# Altium schematic sheet Input filter.SchDoc
size A4; SheetNumber: 6; SheetTotal: 8
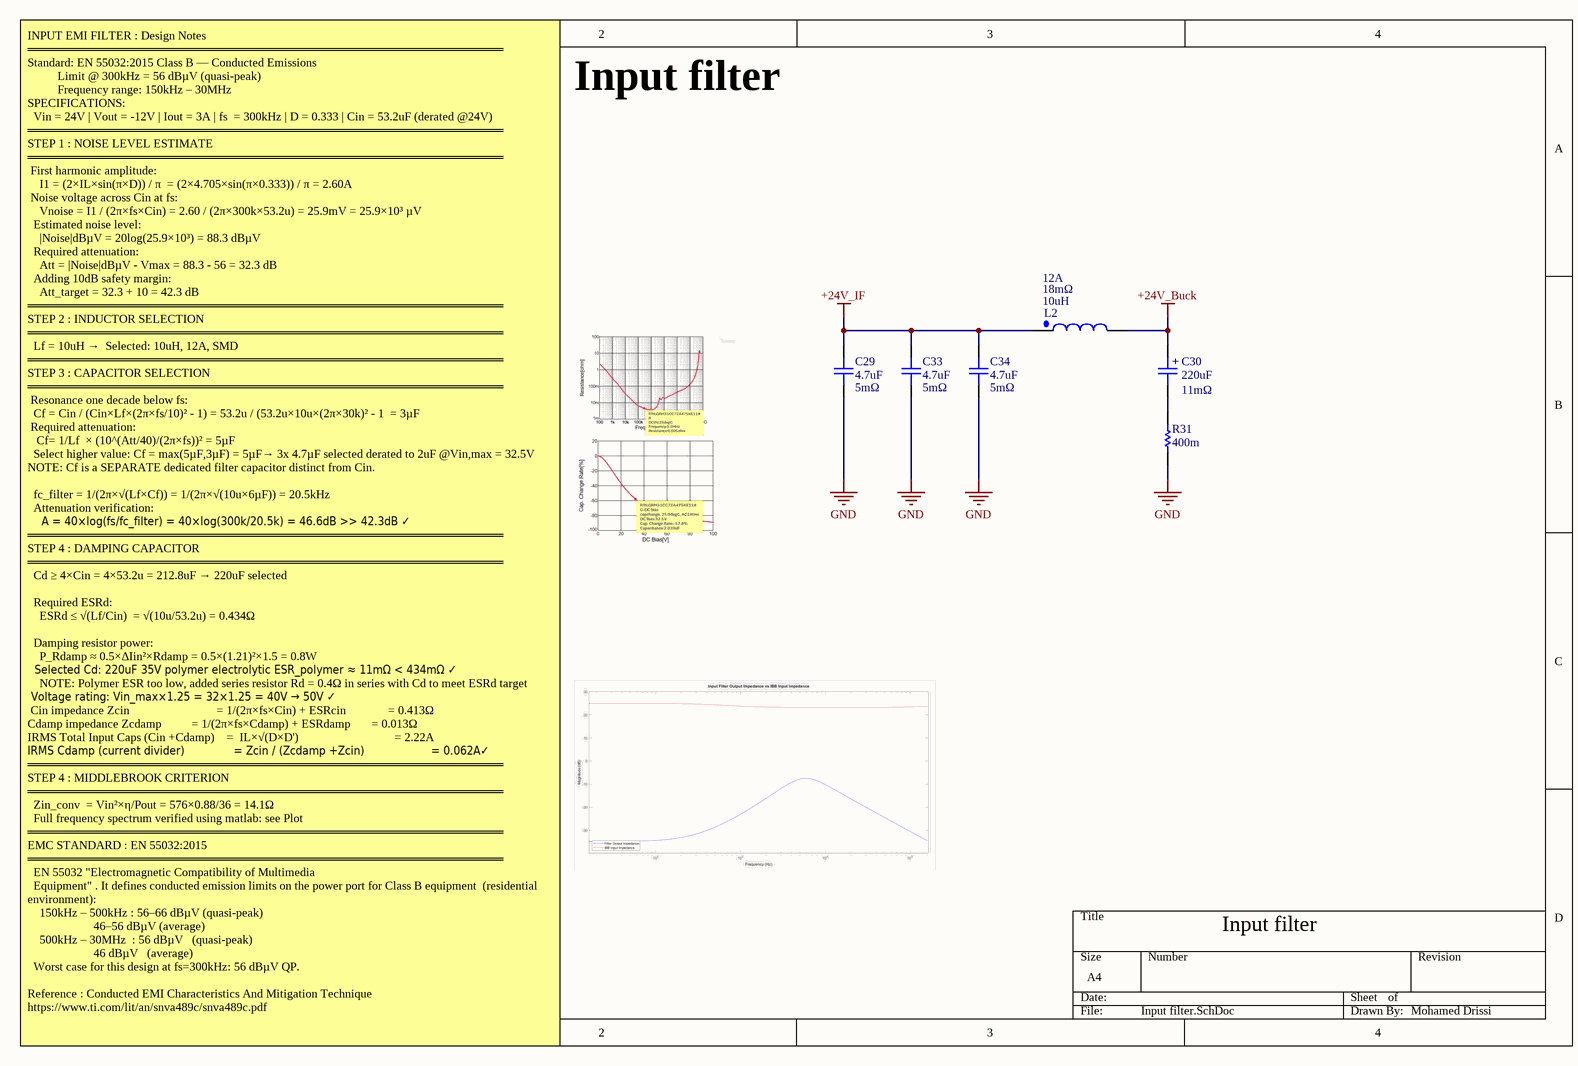
[diagram p0: Input filter.SchDoc]

## Parts
C29  Capacitance: 4.7uF  ESR: 5mΩ  [cap_1206]  (hidden comment: GRM31CC72A475KE11)
C30  ESR (Equivalent Series Resistance): 11mΩ  Capacitance: 220uF  [CAP_POL_10×16.5]  (hidden comment: A786MW227M1HLAS011)
C33  Capacitance: 4.7uF  ESR: 5mΩ  [cap_1206]  (hidden comment: GRM31CC72A475KE11)
C34  Capacitance: 4.7uF  ESR: 5mΩ  [cap_1206]  (hidden comment: GRM31CC72A475KE11)
L2  DC Resistance (DCR): 18mΩ  Max Current Rating: 12A  Inductance: 10uH  [INDPM135125X650N]  (hidden comment: SRP1265CC-100M)
R31  Resistance: 400m  [res_1206]  (hidden comment: MFHA1206R4000FC)

## Nets
+24V_Buck: C30.1 L2.2
+24V_IF: C29.2 C33.2 C34.2 L2.1
GND: C29.1 C33.1 C34.1 R31.1
NetC30_2: C30.2 R31.2

## Notes on the sheet
- Input filter
- INPUT EMI FILTER : Design Notes
  ════════════════════════════════════════════════════════
  Standard: EN 55032:2015 Class B — Conducted Emissions
  Limit @ 300kHz = 56 dBµV (quasi-peak)
  Frequency range: 150kHz – 30MHz
  SPECIFICATIONS:
  Vin = 24V | Vout = -12V | Iout = 3A | fs  = 300kHz | D = 0.333 | Cin = 53.2uF (derated @24V)
  ════════════════════════════════════════════════════════
  STEP 1 : NOISE LEVEL ESTIMATE
  ════════════════════════════════════════════════════════
  First harmonic amplitude:
  I1 = (2×IL×sin(π×D)) / π  = (2×4.705×sin(π×0.333)) / π = 2.60A
  Noise voltage across Cin at fs:
  Vnoise = I1 / (2π×fs×Cin) = 2.60 / (2π×300k×53.2u) = 25.9mV = 25.9×10³ µV
  Estimated noise level:
  |Noise|dBµV = 20log(25.9×10³) = 88.3 dBµV
  Required attenuation:
  Att = |Noise|dBµV - Vmax = 88.3 - 56 = 32.3 dB
  Adding 10dB safety margin:
  Att_target = 32.3 + 10 = 42.3 dB
  ════════════════════════════════════════════════════════
  STEP 2 : INDUCTOR SELECTION
  ════════════════════════════════════════════════════════
  Lf = 10uH →  Selected: 10uH, 12A, SMD
  ════════════════════════════════════════════════════════
  STEP 3 : CAPACITOR SELECTION
  ════════════════════════════════════════════════════════
  Resonance one decade below fs:
  Cf = Cin / (Cin×Lf×(2π×fs/10)² - 1) = 53.2u / (53.2u×10u×(2π×30k)² - 1  = 3µF
  Required attenuation:
  Cf= 1/Lf  × (10^(Att/40)/(2π×fs))² = 5µF
  Select higher value: Cf = max(5µF,3µF) = 5µF→ 3x 4.7µF selected derated to 2uF @Vin,max = 32.5V
  NOTE: Cf is a SEPARATE dedicated filter capacitor distinct from Cin.
  fc_filter = 1/(2π×√(Lf×Cf)) = 1/(2π×√(10u×6µF)) = 20.5kHz
  Attenuation verification:
  A = 40×log(fs/fc_filter) = 40×log(300k/20.5k) = 46.6dB >> 42.3dB ✓
  ════════════════════════════════════════════════════════
  STEP 4 : DAMPING CAPACITOR
  ════════════════════════════════════════════════════════
  Cd ≥ 4×Cin = 4×53.2u = 212.8uF → 220uF selected
  Required ESRd:
  ESRd ≤ √(Lf/Cin)  = √(10u/53.2u) = 0.434Ω
  Damping resistor power:
  P_Rdamp ≈ 0.5×ΔIin²×Rdamp = 0.5×(1.21)²×1.5 = 0.8W
  Selected Cd: 220uF 35V polymer electrolytic ESR_polymer ≈ 11mΩ < 434mΩ ✓
  NOTE: Polymer ESR too low, added series resistor Rd = 0.4Ω in series with Cd to meet ESRd target
  Voltage rating: Vin_max×1.25 = 32×1.25 = 40V → 50V ✓
  Cin impedance Zcin	                            = 1/(2π×fs×Cin) + ESRcin              = 0.413Ω
  Cdamp impedance Zcdamp	         = 1/(2π×fs×Cdamp) + ESRdamp       = 0.013Ω
  IRMS Total Input Caps (Cin +Cdamp)    =  IL×√(D×D')                                = 2.22A
  IRMS Cdamp (current divider)              = Zcin / (Zcdamp +Zcin)                   = 0.062A✓
  ════════════════════════════════════════════════════════
  STEP 4 : MIDDLEBROOK CRITERION
  ════════════════════════════════════════════════════════
  Zin_conv  = Vin²×η/Pout = 576×0.88/36 = 14.1Ω
  Full frequency spectrum verified using matlab: see Plot
  ════════════════════════════════════════════════════════
  EMC STANDARD : EN 55032:2015
  ════════════════════════════════════════════════════════
  EN 55032 "Electromagnetic Compatibility of Multimedia
  Equipment" . It defines conducted emission limits on the power port for Class B equipment  (residential environment):
  150kHz – 500kHz : 56–66 dBµV (quasi-peak)
  46–56 dBµV (average)
  500kHz – 30MHz  : 56 dBµV   (quasi-peak)
  46 dBµV   (average)
  Worst case for this design at fs=300kHz: 56 dBµV QP.
  Reference : Conducted EMI Characteristics And Mitigation Technique  https://www.ti.com/lit/an/snva489c/snva489c.pdf
- Mohamed Drissi
- (in symbol Kemet A786MW227M1HLAS011) +

## Library data of the parts
C29 C33 C34 = Murata GRM31CC72A475KE11L: 100V 4.7uF X7S ±10% 1206 Multilayer Ceramic Capacitors MLCC - SMD/SMT ROHS; Manufacturer: Murata; Manufacturer Lifecycle Status: IN PRODUCTION; Supplier: RS; Supplier Part Number: 2478147P; Manufacturer Part Number: GRM31CC72A475KE11L; RoHS: Compliant; Category: Ceramic Capacitors; Stock: 688; Pricing: 100=0,389, 500=0,329 (EUR); Case/Package: 1206; Dielectric: X7S; Dielectric Material: Ceramic; Export Control Classification Number (ECCN) Code: EAR99; Height: 1.6mm; Harmonized Tariff Schedule (HTS) Code: 8532.24.00.20; Introduction Date: 2017-02-22; Length: 3.2mm; Lifecycle Status: Production; Material: Ceramic; Max Operating Temperature: 125°C; Min Operating Temperature: -55°C; Mounting Technology: Surface Mount; Number of Terminals: 2; REACH SVHC: Yes; Schedule B: 8532240020, 8532240020|8532240020|8532240020|8532240020|8532240020|8532240020, 8532240020|8532240020|8532240020|8532240020|8532240020|8532240020|8532240020, 8532240020|8532240020|8532240020|8532240020|8532240020|8532240020|8532240020|8532240020; Thickness: 1.6mm; Tolerance: 10%; Voltage Rating: 100V; Voltage Rating (DC): 100V; Width: 1.6mm; ComponentLink1URL: https://datasheet.octopart.com:443/GRM31CC72A475KE11L-Murata-datasheet-141280425.pdf?src-supplier=Geoflip; ComponentLink1Description: https://datasheet.octopart.com:443/GRM31CC72A475KE11L-Murata-datasheet-141280425.pdf?src-supplier=Geoflip; ComponentLink2URL: https://datasheet.octopart.com:443/GRM31CC72A475KE11L-Murata-datasheet-165579666.pdf?src-supplier=TME; ComponentLink2Description: https://datasheet.octopart.com:443/GRM31CC72A475KE11L-Murata-datasheet-165579666.pdf?src-supplier=TME; ComponentLink3URL: https://datasheet.octopart.com:443/GRM31CC72A475KE11L-Murata-datasheet-140709036.pdf?src-supplier=Ciiva; ComponentLink3Description: https://datasheet.octopart.com:443/GRM31CC72A475KE11L-Murata-datasheet-140709036.pdf?src-supplier=Ciiva; ComponentLink4URL: https://datasheet.octopart.com:443/GRM31CC72A475KE11L-Murata-datasheet-138746279.pdf?src-supplier=Ciiva; ComponentLink4Description: https://datasheet.octopart.com:443/GRM31CC72A475KE11L-Murata-datasheet-138746279.pdf?src-supplier=Ciiva; ComponentLink5URL: https://datasheet.octopart.com/GRM31CC72A475KE11L-Murata-datasheet-12515295.pdf; ComponentLink5Description: https://datasheet.octopart.com/GRM31CC72A475KE11L-Murata-datasheet-12515295.pdf; ComponentLink6URL: https://datasheet.octopart.com/GRM31CC72A475KE11L-Murata-datasheet-12510076.pdf; ComponentLink6Description: https://datasheet.octopart.com/GRM31CC72A475KE11L-Murata-datasheet-12510076.pdf; ComponentLink7URL: https://datasheet.octopart.com/GRM31CC72A475KE11L-Murata-datasheet-11978611.pdf; ComponentLink7Description: https://datasheet.octopart.com/GRM31CC72A475KE11L-Murata-datasheet-11978611.pdf; ComponentLink8URL: https://datasheet.octopart.com/GRM31CC72A475KE11L-Murata-datasheet-10025737.pdf; ComponentLink8Description: https://datasheet.octopart.com/GRM31CC72A475KE11L-Murata-datasheet-10025737.pdf; ComponentLink9URL: https://datasheet.octopart.com/GRM31CC72A475KE11L-Murata-datasheet-8819587.pdf; ComponentLink9Description: https://datasheet.octopart.com/GRM31CC72A475KE11L-Murata-datasheet-8819587.pdf; ComponentLink10URL: http://sigma.octopart.com:80/reach_statement/Murata-company-16.pdf?src-supplier=Compliance+Statements; ComponentLink10Description: http://sigma.octopart.com:80/reach_statement/Murata-company-16.pdf?src-supplier=Compliance+Statements
C30 = Kemet A786MW227M1HLAS011: Cap, Alu Elec, Hybrid, 220Uf, 50V, Smd Rohs Compliant: Yes |Kemet A786MW227M1HLAS011; Manufacturer: Yageo Group; Leakage Current: 110µA; Ripple Current: 924mA; Supplier: DigiKey; Supplier Part Number: 399-A786MW227M1HLAS011TR-ND; Manufacturer Part Number: A786MW227M1HLAS011; Category: Aluminum Electrolytic Capacitors; Stock: 1490; Pricing: 250=0,60712, 500=0,5608, 750=0,53743, 1250=0,51136, 1750=0,49604, 2500=0,48124 (USD); Diameter: 10mm; Export Control Classification Number (ECCN) Code: EAR99; Height: 16.5mm; Harmonized Tariff Schedule (HTS) Code: 8532.22.00.20; Introduction Date: 2025-03-11; Length: 10.3mm; Lifecycle Status: Production; Max Operating Temperature: 135°C; Min Operating Temperature: -55°C; Mounting Technology: Surface Mount; Number of Terminals: 2; Ratings: AEC-Q200; Voltage Rating (DC): 50V; Width: 10.3mm; ComponentLink1URL: https://datasheet.octopart.com:443/A786MW227M1HLAS011-KEMET-datasheet-188909869.pdf?src-supplier=Newark; ComponentLink1Description: https://datasheet.octopart.com:443/A786MW227M1HLAS011-KEMET-datasheet-188909869.pdf?src-supplier=Newark; ComponentLink2URL: https://datasheet.octopart.com:443/A786MW227M1HLAS011-KEMET-datasheet-192653909.pdf?src-supplier=Newark; ComponentLink2Description: https://datasheet.octopart.com:443/A786MW227M1HLAS011-KEMET-datasheet-192653909.pdf?src-supplier=Newark
L2 = Bourns SRP1265CC-100M: Inductor Power Shielded Wirewound 10uH 20% 100KHz 20Q-FactorCarbonyl Powder 12A 0.018Ohm DCR T/R; Manufacturer: Bourns; Number of Circuits: 1; Q Factor: 20; Self Resonant Frequency: 10MHz; Supplier: Arrow Electronics; Supplier Part Number: SRP1265CC-100M; Manufacturer Part Number: SRP1265CC-100M; RoHS: Compliant; Category: Fixed Inductors; Stock: 5; Pricing: 1=0,7639 (USD); Core Material: Carbonyl Powder; Export Control Classification Number (ECCN) Code: EAR99; Height: 6.2mm; Harmonized Tariff Schedule (HTS) Code: 8504.50.80.00; Introduction Date: 2023-07-18; Length: 13.5mm; Lifecycle Status: Production; Max Operating Temperature: 125°C; Min Operating Temperature: -40°C; Number of Terminals: 2; REACH SVHC: Yes; Shielding: Shielded; Test Frequency: 100kHz; Tolerance: 20%; Width: 12.5mm; ComponentLink1URL: https://datasheet.octopart.com:443/SRP1265CC-100M-Bourns-datasheet-179984565.pdf?src-supplier=IHS; ComponentLink1Description: https://datasheet.octopart.com:443/SRP1265CC-100M-Bourns-datasheet-179984565.pdf?src-supplier=IHS; ComponentLink2URL: http://sigma.octopart.com:80/conflict_mineral_statement/Bourns-company-36.pdf?src-supplier=Compliance+Statements; ComponentLink2Description: http://sigma.octopart.com:80/conflict_mineral_statement/Bourns-company-36.pdf?src-supplier=Compliance+Statements
R31 = Eaton MFHA1206R4000FC: Res Metal Film 1206 0.4 Ohm 1% 1W ±100ppm/C Pad SMD T/R Automotive AEC-Q200; Manufacturer: Eaton; Temperature Coefficient: 100ppm/°C; Working Voltage: 632.5mV; Supplier: Future Electronics; Supplier Part Number: MFHA1206R4000FC; Manufacturer Part Number: MFHA1206R4000FC; RoHS: Compliant; Category: Chip SMD Resistors; Stock: 5000; Pricing: 5000=0,0475, 10000=0,0467, 15000=0,0463, 20000=0,0459, 25000=0,0449 (USD); Case/Package: 1206; Composition: Metal Film; Export Control Classification Number (ECCN) Code: EAR99; Height: 550µm; Harmonized Tariff Schedule (HTS) Code: 8533.21.00.30; Introduction Date: 2022-08-04; Length: 3.2mm; Lifecycle Status: Production; Max Operating Temperature: 155°C; Min Operating Temperature: -55°C; Mounting Technology: Surface Mount; Number of Terminals: 2; Power Rating: 1W; Ratings: AEC-Q200; REACH SVHC: Yes; Tolerance: 1%; Width: 1.6mm; ComponentLink1URL: https://datasheet.octopart.com:443/MFHA1206R4000FC-Cooper-Bussmann-datasheet-182142309.pdf?src-supplier=IHS; ComponentLink1Description: https://datasheet.octopart.com:443/MFHA1206R4000FC-Cooper-Bussmann-datasheet-182142309.pdf?src-supplier=IHS